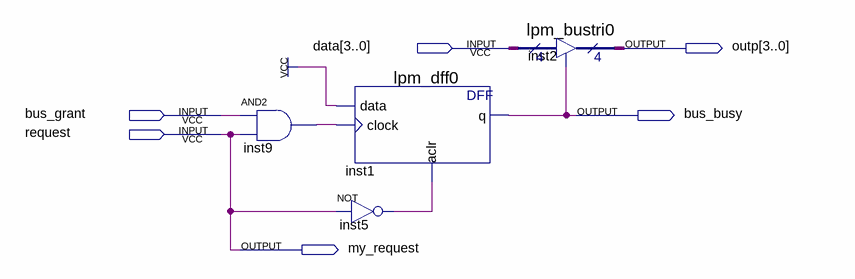
[diagram p0: schematic sheet]
// Quartus schematic deviceLast.bdf as structural Verilog: 4 symbols, 6 pins
module deviceLast (
  input  [3:0] data,
  input  bus_grant,
  input  request,
  output [3:0] outp,
  output bus_busy,
  output my_request
);

  wire inst5_out, inst9_out;

  and inst9 (inst9_out, bus_grant, request);
  lpm_dff0 inst1 (.data(1'b1), .clock(inst9_out), .aclr(inst5_out), .q(bus_busy));
  not inst5 (inst5_out, request);
  lpm_bustri0 inst2 (.enabledt(bus_busy), .data(data), .tridata(outp));

  assign my_request = request;
endmodule
